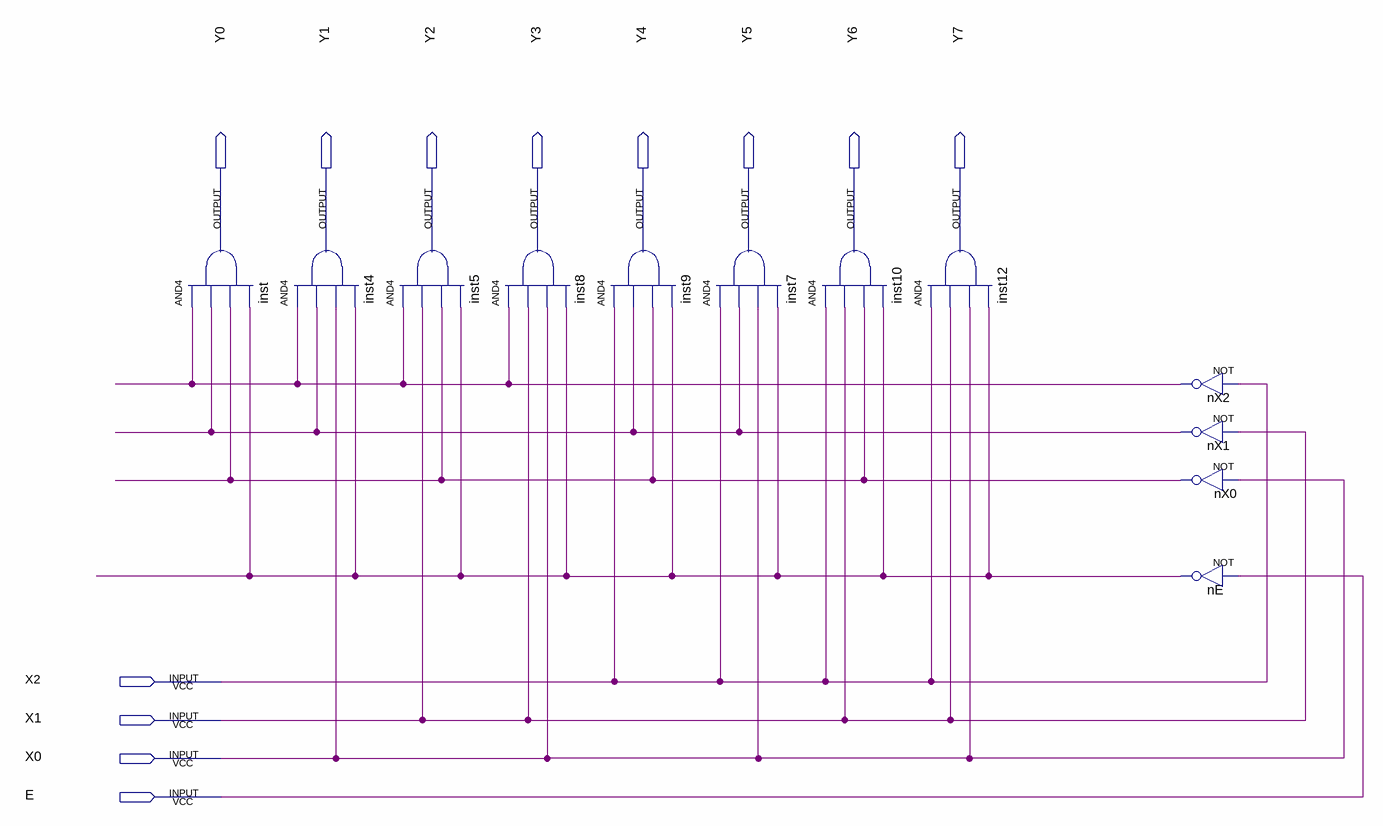
[diagram p0: schematic sheet]
// Quartus schematic pract3.bdf as structural Verilog: 12 symbols, 12 pins
module pract3 (
  input  X2,
  input  X1,
  input  X0,
  input  E,
  output Y0,
  output Y1,
  output Y2,
  output Y3,
  output Y4,
  output Y5,
  output Y6,
  output Y7
);

  wire nE_out, nX0_out, nX1_out, nX2_out;

  and inst (Y0, nX2_out, nX1_out, nX0_out, nE_out);
  and inst4 (Y1, nX2_out, nX1_out, X0, nE_out);
  and inst5 (Y2, nX2_out, X1, nX0_out, nE_out);
  and inst8 (Y3, nX2_out, X1, X0, nE_out);
  and inst9 (Y4, X2, nX1_out, nX0_out, nE_out);
  and inst7 (Y5, X2, nX1_out, X0, nE_out);
  and inst10 (Y6, X2, X1, nX0_out, nE_out);
  and inst12 (Y7, X2, X1, X0, nE_out);
  not nX2 (nX2_out, X2);
  not nX1 (nX1_out, X1);
  not nX0 (nX0_out, X0);
  not nE (nE_out, E);
endmodule
